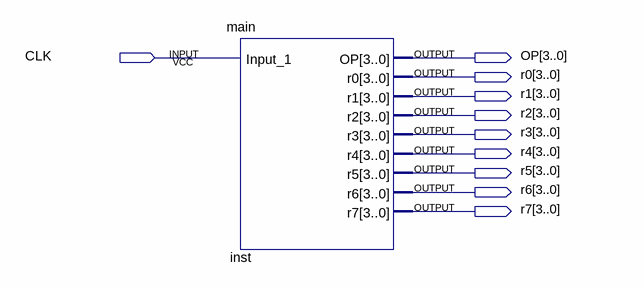
[diagram p0: schematic sheet]
// Quartus schematic Block2.bdf as structural Verilog: 1 symbols, 10 pins
module Block2 (
  input  CLK,
  output [3:0] OP,
  output [3:0] r0,
  output [3:0] r1,
  output [3:0] r2,
  output [3:0] r3,
  output [3:0] r4,
  output [3:0] r5,
  output [3:0] r6,
  output [3:0] r7
);

  main inst (.Input_1(CLK), .OP(OP), .r0(r0), .r1(r1), .r2(r2), .r3(r3), .r4(r4), .r5(r5), .r6(r6), .r7(r7));
endmodule
